# Altium project 8051_at89s52.PrjPCB
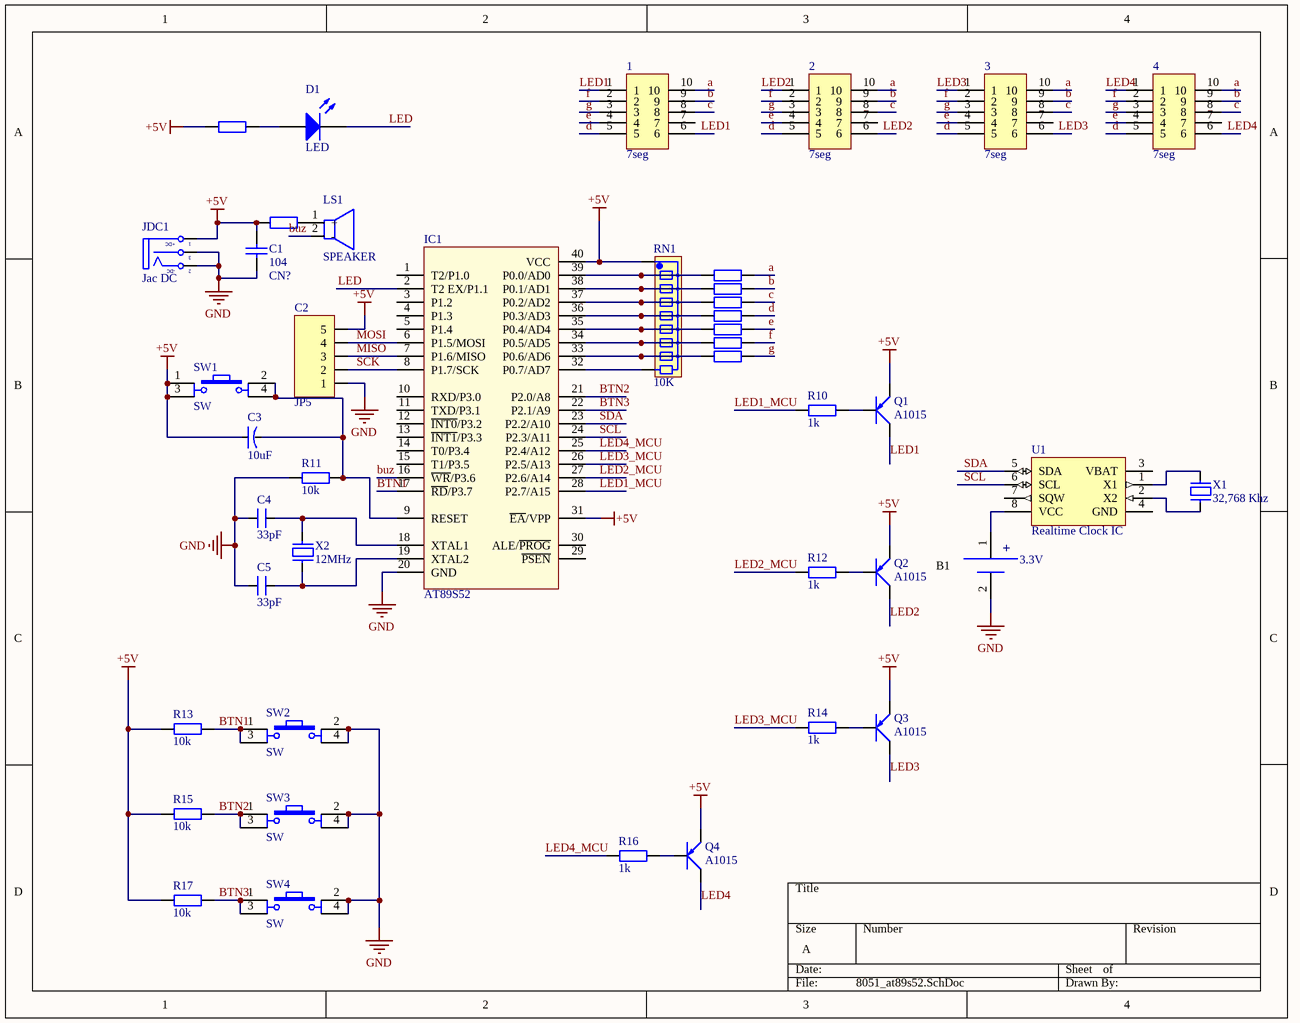
[diagram p0: 8051_at89s52.SchDoc]
1 sheet, 43 parts. Net scope: global (net labels, ports and power ports of the same name join across sheets).
Board file: 8051_at89s52.PcbDoc

## Sheet 8051_at89s52.SchDoc
size A

### Parts
1  7seg  [SM410361N]
2  7seg  [SM410361N]
3  7seg  [SM410361N]
4  7seg  [SM410361N]
B1  value 3.3V  [BATT-LI-Bott-22mm]  (hidden comment: BATT-Holder)
C1  104  value CN?  [CAP_0805]
C2  JP5  [JP5-C1T]
C3  10uF  [CA-ALU-2.54]
C4  33pF  [CN1]
C5  33pF  [CN1]
D1  LED  [LED-0 5mm YELLOW]
IC1  AT89S52  [DIP40/W0.6]
JDC1  Jac DC  [DC3]
LS1  SPEAKER  [speaker]
Q1  A1015  [QTO-92]
Q2  A1015  [QTO-92]
Q3  A1015  [QTO-92]
Q4  A1015  [QTO-92]
R1  1k  [R1/4W]  (value not drawn)
R2  1k  [R1/4W]  (value not drawn)
R3  1k  [R1/4W]  (value not drawn)
R4  1k  [R1/4W]  (value not drawn)
R5  1k  [R1/4W]  (value not drawn)
R6  1k  [R1/4W]  (value not drawn)
R7  1k  [R1/4W]  (value not drawn)
R8  1k  [R1/4W]  (value not drawn)
R9  1k  [R1/4W]  (value not drawn)
R10  1k  [R1/4W]
R11  10k  [RES-1/4W]
R12  1k  [R1/4W]
R13  10k  [R1/4W]
R14  1k  [R1/4W]
R15  10k  [R1/4W]
R16  1k  [R1/4W]
R17  10k  [R1/4W]
RN1  10K  [RN8]
SW1  SW  [SW4]
SW2  SW  [SW4]
SW3  SW  [SW4]
SW4  SW  [SW4]
U1  Realtime Clock IC  [DS1307.Dip8]
X1  32,768 Khz  [XT32k]
X2  12MHz  [XT2]

### Nets
+5V: C1.2 C2.5 C3.1 IC1.31(~{EA}/VPP) IC1.40(VCC) JDC1.1(T) Q1.1(E) Q2.1(E) Q3.1(E) Q4.1(E) R1.1 R2.1 R13.1 R15.1 R17.1 RN1.1 SW1.1 SW1.3
GND: B1.2(-) C1.1 C2.1 C4.1 C5.1 IC1.20(GND) JDC1.2(TN) JDC1.3(S) R11.1 SW2.2 SW2.4 SW3.2 SW3.4 SW4.2 SW4.4
a: 1.10 2.10 3.10 4.10 R3.2
b: 1.9 2.9 3.9 4.9 R4.2
BTN1: IC1.17(~{RD}/P3.7) R13.2 SW2.1 SW2.3
BTN2: IC1.21(P2.0/A8) R15.2 SW3.1 SW3.3
BTN3: IC1.22(P2.1/A9) R17.2 SW4.1 SW4.3
buz: IC1.16(~{WR}/P3.6) LS1.2(-)
c: 1.8 2.8 3.8 4.8 R5.2
d: 1.5 2.5 3.5 4.5 R6.2
e: 1.4 2.4 3.4 4.4 R7.2
f: 1.2 2.2 3.2 4.2 R8.2
g: 1.3 2.3 3.3 4.3 R9.2
LED: D1.2(K) IC1.2(T2_EX/P1.1)
LED1: 1.1 1.6 Q1.2(C)
LED1_MCU: IC1.28(P2.7/A15) R10.1
LED2: 2.1 2.6 Q2.2(C)
LED2_MCU: IC1.27(P2.6/A14) R12.1
LED3: 3.1 3.6 Q3.2(C)
LED3_MCU: IC1.26(P2.5/A13) R14.1
LED4: 4.1 4.6 Q4.2(C)
LED4_MCU: IC1.25(P2.4/A12) R16.1
MISO: C2.3 IC1.7(P1.6/MISO)
MOSI: C2.4 IC1.6(P1.5/MOSI)
SCK: C2.2 IC1.8(P1.7/SCK)
SCL: IC1.24(P2.3/A11) U1.6(SCL)
SDA: IC1.23(P2.2/A10) U1.5(SDA)
NetB1_1: B1.1(+) U1.8(VCC)
NetC3_2: C3.2 IC1.9(RESET) R11.2 SW1.2 SW1.4
NetC4_2: C4.2 IC1.18(XTAL1) X2.2
NetC5_2: C5.2 IC1.19(XTAL2) X2.1
NetD1_1: D1.1(A) R1.2
NetIC1_32: IC1.32(P0.7/AD7) RN1.9
NetIC1_33: IC1.33(P0.6/AD6) R9.1 RN1.8
NetIC1_34: IC1.34(P0.5/AD5) R8.1 RN1.7
NetIC1_35: IC1.35(P0.4/AD4) R7.1 RN1.6
NetIC1_36: IC1.36(P0.3/AD3) R6.1 RN1.5
NetIC1_37: IC1.37(P0.2/AD2) R5.1 RN1.4
NetIC1_38: IC1.38(P0.1/AD1) R4.1 RN1.3
NetIC1_39: IC1.39(P0.0/AD0) R3.1 RN1.2
NetLS1_1: LS1.1(+) R2.2
NetQ1_3: Q1.3(B) R10.2
NetQ2_3: Q2.3(B) R12.2
NetQ3_3: Q3.3(B) R14.2
NetQ4_3: Q4.3(B) R16.2
NetU1_1: U1.1(X1) X1.2
NetU1_2: U1.2(X2) X1.1

Not connected (* = marked no-connect by the designer): 1 7; 2 7; 3 7; 4 7; IC1 1(T2/P1.0) 3(P1.2) 4(P1.3) 5(P1.4) 10(RXD/P3.0) 11(TXD/P3.1) 12(~{INT0}/P3.2) 13(~{INT1}/P3.3) 14(T0/P3.4) 15(T1/P3.5) 29(~{PSEN}) 30(ALE/~{PROG}); U1 3(VBAT) 4(GND) 7(SQW)

### Notes on the sheet
- (in symbol DCIN) +DC; -DC

### Library data of the parts
1-4 = SM410361N: 7seg 0,36''
B1 = BATT-Holder: Battery holder; Manufacturer: China; Vendor: Digikey; Publisher: Hoang Nguyen; Published: 13-April-2009; ComponentLink1Description: Digikey Part Link; ComponentLink2Description: Open Datasheet; ComponentLink2URL: H:\LIBRARY\LIBRARY.Datasheet\; Price: 3000 VND
C1 = Cap Semi: Capacitor (Semiconductor SIM Model); LatestRevisionDate: 17-Jul-2002; LatestRevisionNote: Re-released for DXP Platform.; PackageReference: C1206; Publisher: Altium Limited; Value: 104
C2 = JP5: WR-PHD 2.54 mm Angled Socket Header; Manufacturer: W¨¹rth Elektronik eiSos GmbH; partNo: 613005143121; ComponentLink1 Description: Manufacturer; ComponentLink2 Description: Datasheet; NoPins: 05; Created Date: 29 March 2013; ComponentLink1URL: http://www.we-online.com; ComponentLink2URL: http://katalog.we-online.de/em/datasheet/6130xx143121.pdf; Created by: Karrer Zheng
C3 = CN-ALU-DIP: Capacitor (Semiconductor SIM Model); Value: 104; LatestRevisionDate: 17-Jul-2002; LatestRevisionNote: Re-released for DXP Platform.; PackageReference: C1206; Publisher: Altium Limited
C4 C5 = CN1: Cap np  1pF - 472pF; Value: 100pF
D1 = LED: Typical LED; Published: 8-Jun-2000; LatestRevisionDate: 08-Jul-2005; LatestRevisionNote: Mech Layer 1 removed.; PackageReference: LED-1; Publisher: Altium Limited
IC1 = AT89S52: AT89S52, 8k Byte Flash Memory , 40 Pin; Value: AT89S52
JDC1 = DCIN: Jac DC input; Value: Jac DC
LS1 = SPEAKER: Vendor: Digikey; Published: 13-April-2009; Publisher: Hoang Nguyen; ComponentLink1Description: Digikey Part Link; ComponentLink2Description: Open Datasheet; ComponentLink2URL: H:\LIBRARY\LIBRARY.Datasheet\
Q1-Q4 = A1015_1: PNP 600mW, ECB; Value: A1015
R1-R17 = R1/4W: Resistor 1/4W; Value: R1/4W - 1K
RN1 = RN8: Resistor 8 (Thanh); Value: Tro thanh 10K
SW1-SW4 = SW4: Switch button 4 pin; Value: Button chip 4 pin
U1 = DS1307: Manufacturer: Maxim; ComponentLink1Description: Digikey Part Link; ComponentLink2Description: Open Datasheet; ComponentLink2URL: H:\LIBRARY\LIBRARY.Datasheet\DS1307.pdf
X1 = XT32k: Crystal 32,768kHz for timer real; Value: 32,768khz
X2 = XT2: Crystal For all Crystal 2pin.; Value: 4Mhz